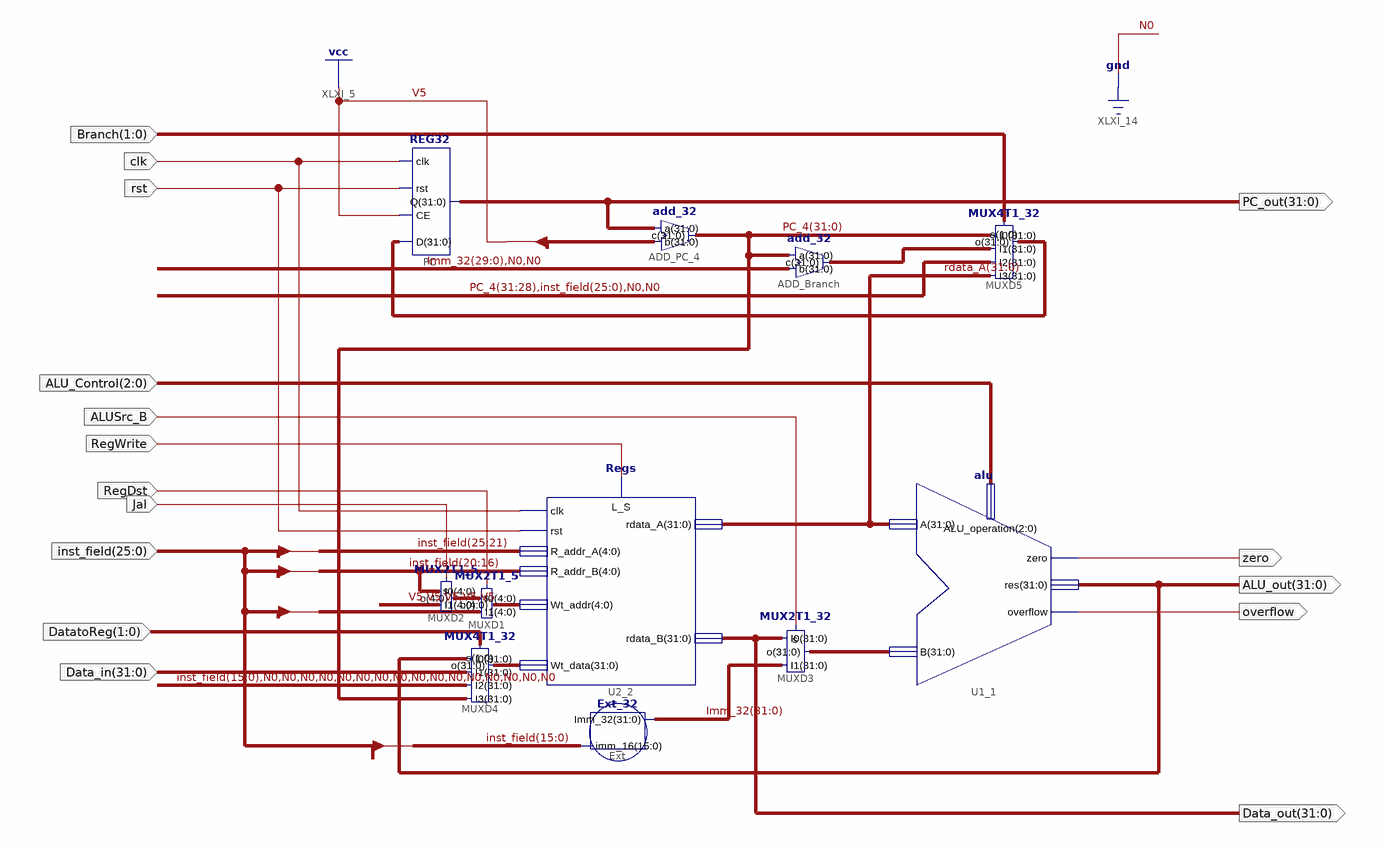
[diagram p0: schematic sheet 1]
// Xilinx ISE schematic Data_path_more.sch (kintex7) as structural Verilog: 11 symbols, 16 ports
module Data_path_more (
  input  clk,
  input  rst,
  input  RegDst,
  input  [1:0] DatatoReg,
  input  [31:0] Data_in,
  input  RegWrite,
  input  [25:0] inst_field,
  input  ALUSrc_B,
  input  [2:0] ALU_Control,
  input  [1:0] Branch,
  input  Jal,
  output [31:0] Data_out,
  output [31:0] ALU_out,
  output [31:0] PC_out,
  output zero,
  output overflow
);

  wire [4:0] XLXN_10, XLXN_61;
  wire [31:0] Imm_32, PC_4, rdata_A, XLXN_3, XLXN_9, XLXN_35, XLXN_40;

  REG32 PC (.D(XLXN_40), .CE(1'b1), .rst(rst), .clk(clk), .Q(PC_out));
  Regs U2_2 (
    .clk(clk), .L_S(RegWrite), .rdata_A(rdata_A), .rst(rst), .Wt_data(XLXN_9), .rdata_B(Data_out),
    .R_addr_A(inst_field[25:21]), .R_addr_B(inst_field[20:16]), .Wt_addr(XLXN_10));
  alu U1_1 (.zero(zero), .res(ALU_out), .overflow(overflow), .A(rdata_A), .B(XLXN_3), .ALU_operation(ALU_Control));
  MUX2T1_32 MUXD3 (.s(ALUSrc_B), .I0(Data_out), .I1(Imm_32), .o(XLXN_3));
  MUX2T1_5 MUXD1 (.I1(inst_field[15:11]), .I0(XLXN_61), .o(XLXN_10), .s(RegDst));
  Ext_32 Ext (.imm_16(inst_field[15:0]), .Imm_32(Imm_32));
  add_32 ADD_PC_4 (.c(PC_4), .a(PC_out), .b(32'b00000000000000000000000000000100));
  add_32 ADD_Branch (.c(XLXN_35), .a(PC_4), .b({Imm_32[29:0], 2'b00}));
  MUX4T1_32 MUXD5 (
    .s(Branch), .I0(PC_4), .I1(XLXN_35), .I2({PC_4[31:28], inst_field, 2'b00}), .I3(rdata_A), .o(XLXN_40));
  MUX2T1_5 MUXD2 (.I1({5{1'b1}}), .I0(inst_field[20:16]), .o(XLXN_61), .s(Jal));
  MUX4T1_32 MUXD4 (
    .s(DatatoReg), .I0(ALU_out), .I1(Data_in), .I2({inst_field[15:0], {16{1'b0}}}), .I3(PC_4), .o(XLXN_9));
endmodule
